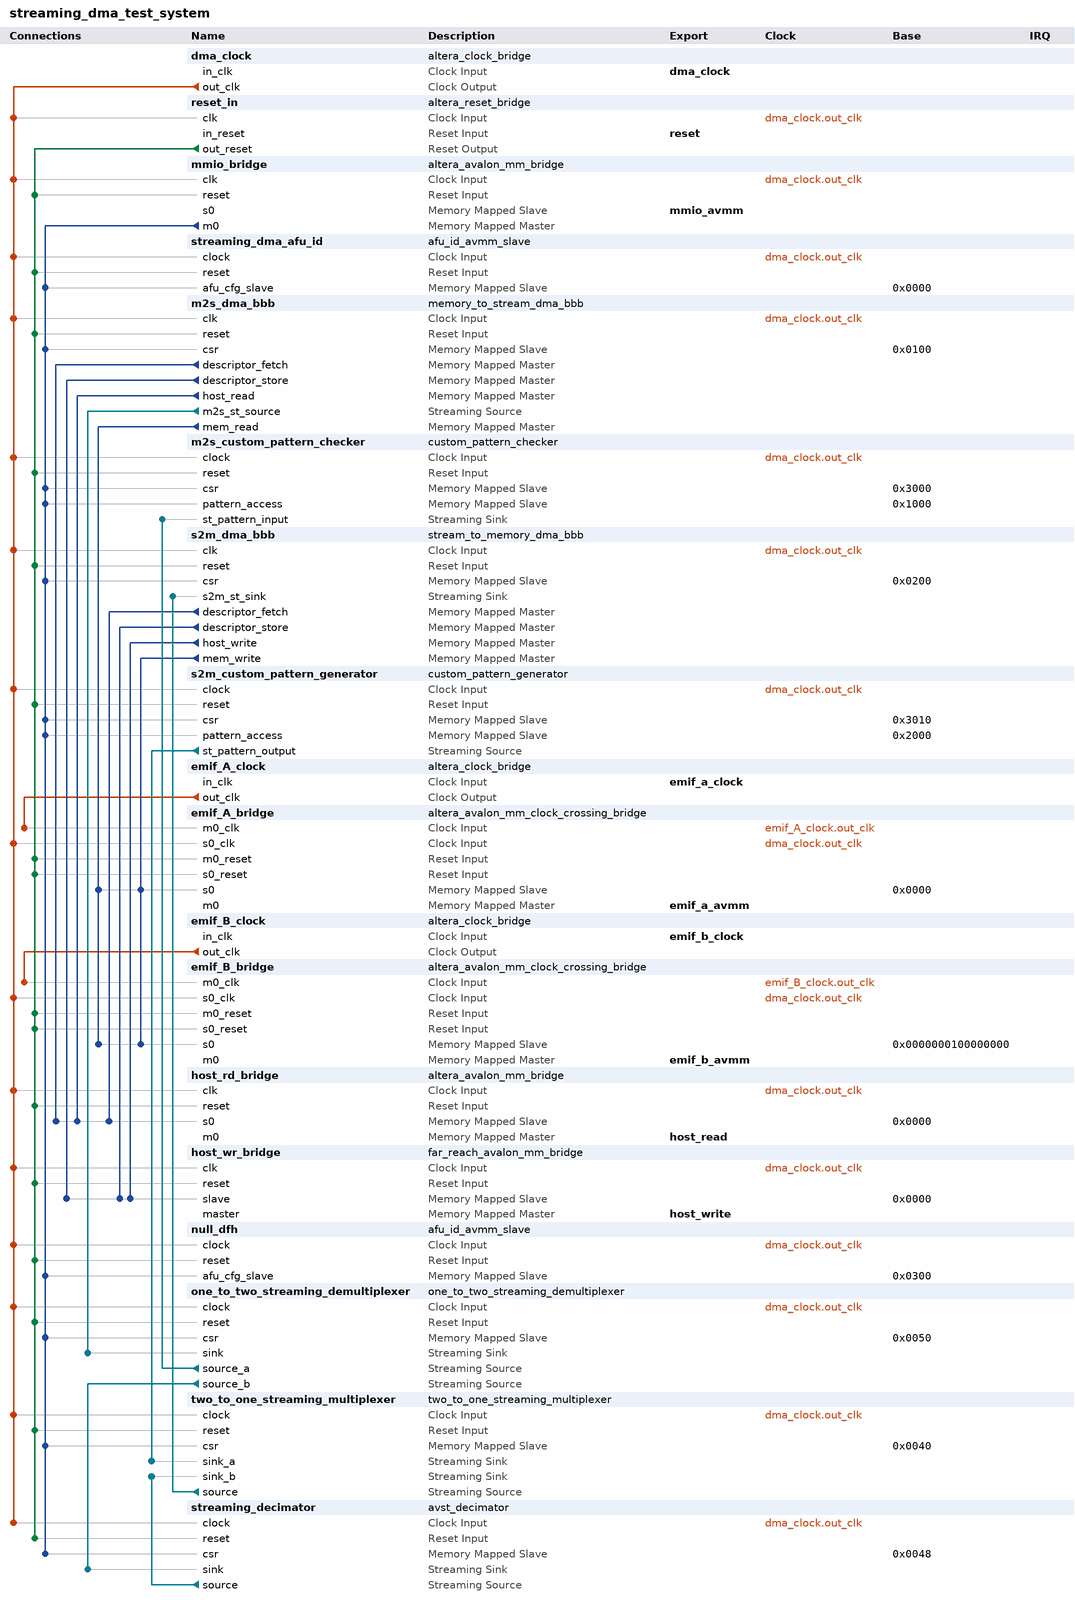
[diagram p0: system contents]
# Platform Designer (Qsys) system streaming_dma_test_system, Arria 10 10AX115N2F40E2LG
# Parameters at their usual value, and those the tool derives, are not listed.
package require -exact qsys 1.0
create_system streaming_dma_test_system
set_project_property DEVICE_FAMILY {Arria 10}
set_project_property DEVICE 10AX115N2F40E2LG

add_component dma_clock ip/streaming_dma_test_system/dma_clock.ip altera_clock_bridge dma_clock 17.1

add_component reset_in ip/streaming_dma_test_system/streaming_dma_test_system_reset_in.ip altera_reset_bridge reset_in 17.1

add_component mmio_bridge ip/streaming_dma_test_system/mmio_bridge.ip altera_avalon_mm_bridge mmio_bridge 17.1

add_component streaming_dma_afu_id ip/streaming_dma_test_system/streaming_dma_afu_id.ip afu_id_avmm_slave streaming_dma_afu_id 1.0
load_component streaming_dma_afu_id
set_component_parameter_value AFU_ID_H 17184258269984344790
set_component_parameter_value AFU_ID_L 9816954852166253795
set_component_parameter_value DFH_FEATURE_TYPE 1
set_component_parameter_value DFH_AFU_MINOR_REV 0
set_component_parameter_value DFH_AFU_MAJOR_REV 0
set_component_parameter_value DFH_END_OF_LIST 0
set_component_parameter_value DFH_NEXT_OFFSET 256
set_component_parameter_value DFH_FEATURE_ID 0
set_component_parameter_value NEXT_AFU_OFFSET 0
set_component_parameter_value CREATE_SCRATCH_REG 0
save_component

add_component m2s_dma_bbb /data/dunnikri/qshell/18.0.1/p4/afu/samples/streaming_dma_afu/hw/rtl/memory_to_stream_dma_bbb/memory_to_stream_dma_bbb.qsys memory_to_stream_dma_bbb m2s_dma_bbb 

add_component m2s_custom_pattern_checker ip/streaming_dma_test_system/m2s_custom_pattern_checker.ip custom_pattern_checker m2s_custom_pattern_checker 2.0

add_component s2m_dma_bbb /data/dunnikri/qshell/18.0.1/p4/afu/samples/streaming_dma_afu/hw/rtl/stream_to_memory_dma_bbb/stream_to_memory_dma_bbb.qsys stream_to_memory_dma_bbb s2m_dma_bbb 

add_component s2m_custom_pattern_generator ip/streaming_dma_test_system/s2m_custom_pattern_generator.ip custom_pattern_generator s2m_custom_pattern_generator 2.0

add_component emif_A_clock ip/streaming_dma_test_system/emif_A_clock.ip altera_clock_bridge emif_A_clock 17.1

add_component emif_A_bridge ip/streaming_dma_test_system/emif_A_bridge.ip altera_avalon_mm_clock_crossing_bridge emif_A_bridge 17.1

add_component emif_B_clock ip/streaming_dma_test_system/emif_B_clock.ip altera_clock_bridge emif_B_clock 17.1

add_component emif_B_bridge ip/streaming_dma_test_system/emif_B_bridge.ip altera_avalon_mm_clock_crossing_bridge emif_B_bridge 17.1

add_component host_rd_bridge ip/streaming_dma_test_system/host_rd_bridge.ip altera_avalon_mm_bridge host_rd_bridge 17.1

add_component host_wr_bridge ip/streaming_dma_test_system/host_wr_bridge.ip far_reach_avalon_mm_bridge host_wr_bridge 1.0

add_component null_dfh ip/streaming_dma_test_system/null_dfh.ip afu_id_avmm_slave null_dfh 1.0

add_component one_to_two_streaming_demultiplexer ip/streaming_dma_test_system/one_to_two_streaming_demultiplexer.ip one_to_two_streaming_demultiplexer one_to_two_streaming_demultiplexer 1.0
load_component one_to_two_streaming_demultiplexer
set_component_parameter_value DATA_WIDTH 512
set_component_parameter_value EMPTY_WIDTH 6
save_component

add_component two_to_one_streaming_multiplexer ip/streaming_dma_test_system/two_to_one_streaming_multiplexer.ip two_to_one_streaming_multiplexer two_to_one_streaming_multiplexer 1.0
load_component two_to_one_streaming_multiplexer
set_component_parameter_value DATA_WIDTH 512
set_component_parameter_value EMPTY_WIDTH 6
save_component

add_component streaming_decimator ip/streaming_dma_test_system/streaming_decimator.ip avst_decimator streaming_decimator 1.0
load_component streaming_decimator
set_component_parameter_value DATA_WIDTH 512
set_component_parameter_value EMPTY_WIDTH 6
save_component

# connections
add_connection dma_clock.out_clk emif_A_bridge.s0_clk clock
add_connection dma_clock.out_clk emif_B_bridge.s0_clk clock
add_connection dma_clock.out_clk host_rd_bridge.clk clock
add_connection dma_clock.out_clk host_wr_bridge.clk clock
add_connection dma_clock.out_clk m2s_custom_pattern_checker.clock clock
add_connection dma_clock.out_clk m2s_dma_bbb.clk clock
add_connection dma_clock.out_clk mmio_bridge.clk clock
add_connection dma_clock.out_clk null_dfh.clock clock
add_connection dma_clock.out_clk one_to_two_streaming_demultiplexer.clock clock
add_connection dma_clock.out_clk reset_in.clk clock
add_connection dma_clock.out_clk s2m_custom_pattern_generator.clock clock
add_connection dma_clock.out_clk s2m_dma_bbb.clk clock
add_connection dma_clock.out_clk streaming_decimator.clock clock
add_connection dma_clock.out_clk streaming_dma_afu_id.clock clock
add_connection dma_clock.out_clk two_to_one_streaming_multiplexer.clock clock
add_connection emif_A_clock.out_clk emif_A_bridge.m0_clk clock
add_connection emif_B_clock.out_clk emif_B_bridge.m0_clk clock
add_connection reset_in.out_reset emif_A_bridge.m0_reset reset
add_connection reset_in.out_reset emif_A_bridge.s0_reset reset
add_connection reset_in.out_reset emif_B_bridge.m0_reset reset
add_connection reset_in.out_reset emif_B_bridge.s0_reset reset
add_connection reset_in.out_reset host_rd_bridge.reset reset
add_connection reset_in.out_reset host_wr_bridge.reset reset
add_connection reset_in.out_reset m2s_custom_pattern_checker.reset reset
add_connection reset_in.out_reset m2s_dma_bbb.reset reset
add_connection reset_in.out_reset mmio_bridge.reset reset
add_connection reset_in.out_reset null_dfh.reset reset
add_connection reset_in.out_reset one_to_two_streaming_demultiplexer.reset reset
add_connection reset_in.out_reset s2m_custom_pattern_generator.reset reset
add_connection reset_in.out_reset s2m_dma_bbb.reset reset
add_connection reset_in.out_reset streaming_decimator.reset reset
add_connection reset_in.out_reset streaming_dma_afu_id.reset reset
add_connection reset_in.out_reset two_to_one_streaming_multiplexer.reset reset
add_connection m2s_dma_bbb.descriptor_fetch host_rd_bridge.s0 avalon
set_connection_parameter_value m2s_dma_bbb.descriptor_fetch/host_rd_bridge.s0 baseAddress 0x0000
add_connection m2s_dma_bbb.descriptor_store host_wr_bridge.slave avalon
set_connection_parameter_value m2s_dma_bbb.descriptor_store/host_wr_bridge.slave baseAddress 0x0000
add_connection m2s_dma_bbb.host_read host_rd_bridge.s0 avalon
set_connection_parameter_value m2s_dma_bbb.host_read/host_rd_bridge.s0 baseAddress 0x0000
add_connection m2s_dma_bbb.mem_read emif_A_bridge.s0 avalon
set_connection_parameter_value m2s_dma_bbb.mem_read/emif_A_bridge.s0 baseAddress 0x0000
add_connection m2s_dma_bbb.mem_read emif_B_bridge.s0 avalon
set_connection_parameter_value m2s_dma_bbb.mem_read/emif_B_bridge.s0 baseAddress 0x0000000100000000
add_connection mmio_bridge.m0 m2s_custom_pattern_checker.csr avalon
set_connection_parameter_value mmio_bridge.m0/m2s_custom_pattern_checker.csr baseAddress 0x3000
add_connection mmio_bridge.m0 m2s_custom_pattern_checker.pattern_access avalon
set_connection_parameter_value mmio_bridge.m0/m2s_custom_pattern_checker.pattern_access baseAddress 0x1000
add_connection mmio_bridge.m0 m2s_dma_bbb.csr avalon
set_connection_parameter_value mmio_bridge.m0/m2s_dma_bbb.csr baseAddress 0x0100
add_connection mmio_bridge.m0 null_dfh.afu_cfg_slave avalon
set_connection_parameter_value mmio_bridge.m0/null_dfh.afu_cfg_slave baseAddress 0x0300
add_connection mmio_bridge.m0 one_to_two_streaming_demultiplexer.csr avalon
set_connection_parameter_value mmio_bridge.m0/one_to_two_streaming_demultiplexer.csr baseAddress 0x0050
add_connection mmio_bridge.m0 s2m_custom_pattern_generator.csr avalon
set_connection_parameter_value mmio_bridge.m0/s2m_custom_pattern_generator.csr baseAddress 0x3010
add_connection mmio_bridge.m0 s2m_custom_pattern_generator.pattern_access avalon
set_connection_parameter_value mmio_bridge.m0/s2m_custom_pattern_generator.pattern_access baseAddress 0x2000
add_connection mmio_bridge.m0 s2m_dma_bbb.csr avalon
set_connection_parameter_value mmio_bridge.m0/s2m_dma_bbb.csr baseAddress 0x0200
add_connection mmio_bridge.m0 streaming_decimator.csr avalon
set_connection_parameter_value mmio_bridge.m0/streaming_decimator.csr baseAddress 0x0048
add_connection mmio_bridge.m0 streaming_dma_afu_id.afu_cfg_slave avalon
set_connection_parameter_value mmio_bridge.m0/streaming_dma_afu_id.afu_cfg_slave baseAddress 0x0000
add_connection mmio_bridge.m0 two_to_one_streaming_multiplexer.csr avalon
set_connection_parameter_value mmio_bridge.m0/two_to_one_streaming_multiplexer.csr baseAddress 0x0040
add_connection s2m_dma_bbb.descriptor_fetch host_rd_bridge.s0 avalon
set_connection_parameter_value s2m_dma_bbb.descriptor_fetch/host_rd_bridge.s0 baseAddress 0x0000
add_connection s2m_dma_bbb.descriptor_store host_wr_bridge.slave avalon
set_connection_parameter_value s2m_dma_bbb.descriptor_store/host_wr_bridge.slave baseAddress 0x0000
add_connection s2m_dma_bbb.host_write host_wr_bridge.slave avalon
set_connection_parameter_value s2m_dma_bbb.host_write/host_wr_bridge.slave baseAddress 0x0000
add_connection s2m_dma_bbb.mem_write emif_A_bridge.s0 avalon
set_connection_parameter_value s2m_dma_bbb.mem_write/emif_A_bridge.s0 baseAddress 0x0000
add_connection s2m_dma_bbb.mem_write emif_B_bridge.s0 avalon
set_connection_parameter_value s2m_dma_bbb.mem_write/emif_B_bridge.s0 baseAddress 0x0000000100000000
add_connection m2s_dma_bbb.m2s_st_source one_to_two_streaming_demultiplexer.sink avalon_streaming
add_connection one_to_two_streaming_demultiplexer.source_a m2s_custom_pattern_checker.st_pattern_input avalon_streaming
add_connection one_to_two_streaming_demultiplexer.source_b streaming_decimator.sink avalon_streaming
add_connection s2m_custom_pattern_generator.st_pattern_output two_to_one_streaming_multiplexer.sink_a avalon_streaming
add_connection streaming_decimator.source two_to_one_streaming_multiplexer.sink_b avalon_streaming
add_connection two_to_one_streaming_multiplexer.source s2m_dma_bbb.s2m_st_sink avalon_streaming

# exported interfaces
add_interface dma_clock clock sink
set_interface_property dma_clock EXPORT_OF dma_clock.in_clk
add_interface emif_a_avmm avalon master
set_interface_property emif_a_avmm EXPORT_OF emif_A_bridge.m0
add_interface emif_a_clock clock sink
set_interface_property emif_a_clock EXPORT_OF emif_A_clock.in_clk
add_interface emif_b_avmm avalon master
set_interface_property emif_b_avmm EXPORT_OF emif_B_bridge.m0
add_interface emif_b_clock clock sink
set_interface_property emif_b_clock EXPORT_OF emif_B_clock.in_clk
add_interface host_read avalon master
set_interface_property host_read EXPORT_OF host_rd_bridge.m0
add_interface host_write avalon master
set_interface_property host_write EXPORT_OF host_wr_bridge.master
add_interface mmio_avmm avalon slave
set_interface_property mmio_avmm EXPORT_OF mmio_bridge.s0
add_interface reset reset sink
set_interface_property reset EXPORT_OF reset_in.in_reset

set_interconnect_requirement {$system} qsys_mm.clockCrossingAdapter HANDSHAKE
set_interconnect_requirement {$system} qsys_mm.enableEccProtection FALSE
set_interconnect_requirement {$system} qsys_mm.insertDefaultSlave FALSE
set_interconnect_requirement {$system} qsys_mm.maxAdditionalLatency 1

save_system streaming_dma_test_system.qsys
